# Altium schematic sheet Peripheral.SchDoc: FlightControlBoard-Peripheral
size A4; SheetNumber: 3; SheetTotal: 5
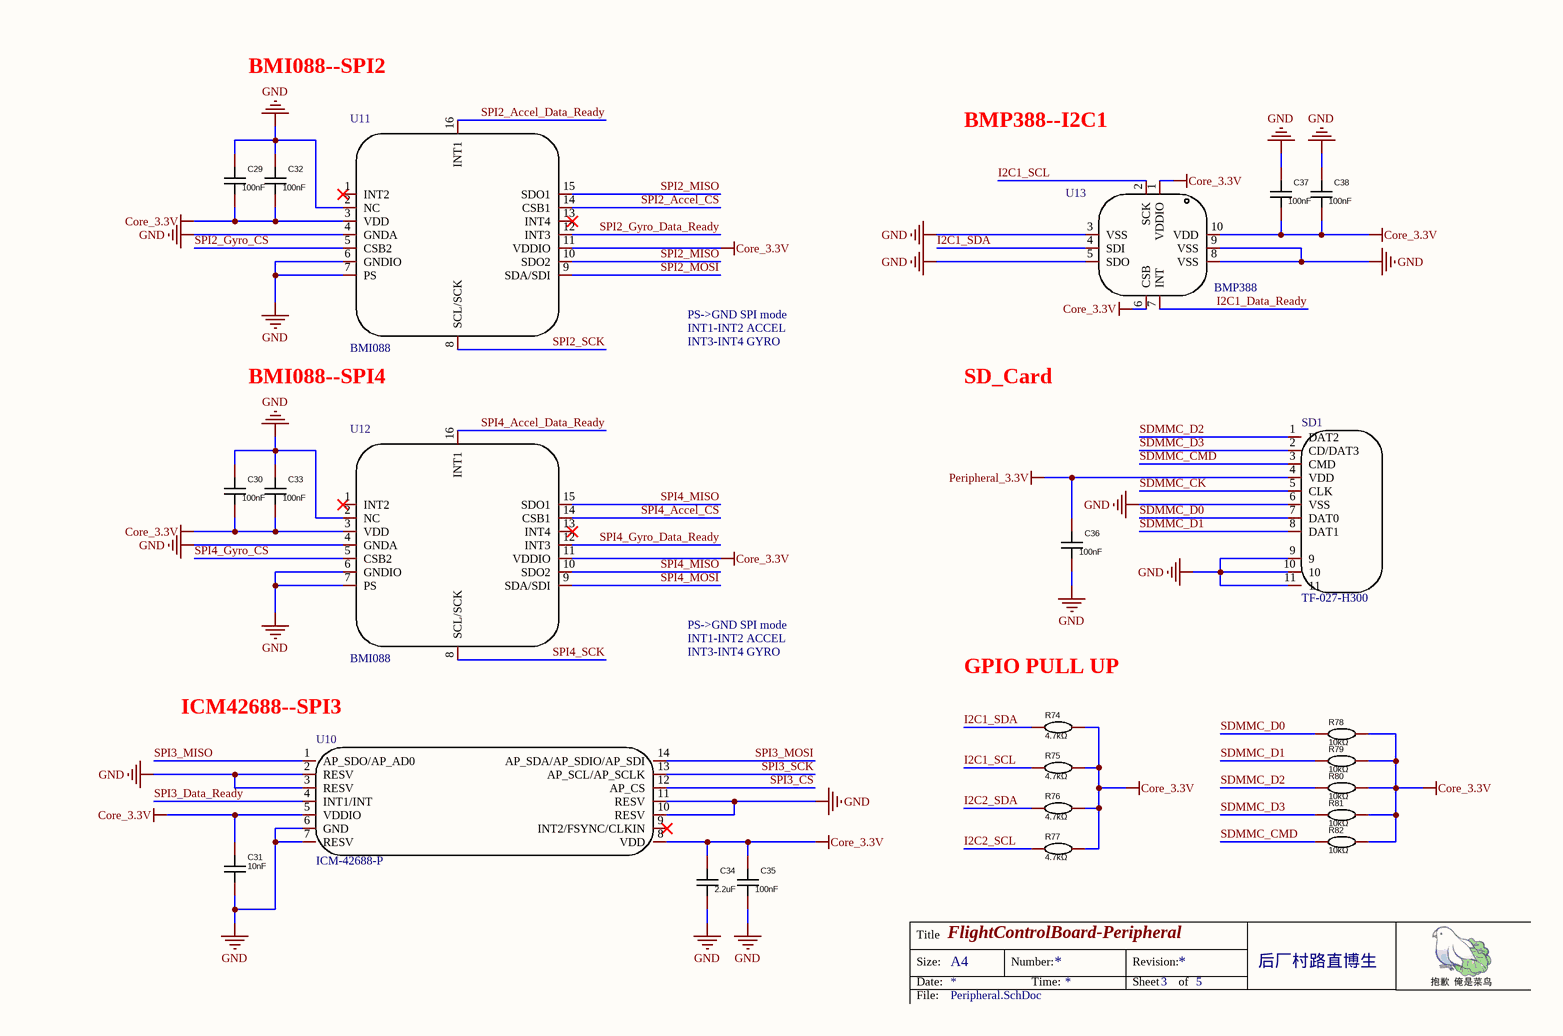
[diagram p0: Peripheral.SchDoc]

## Parts
C29  100nF  [C0201]
C30  100nF  [C0201]
C31  10nF  [C0201]
C32  100nF  [C0201]
C33  100nF  [C0201]
C34  2.2uF  [C0402]
C35  100nF  [C0201]
C36  100nF  [C0201]
C37  100nF  [C0201]
C38  100nF  [C0201]
R74  4.7kΩ  [R0201]
R75  4.7kΩ  [R0201]
R76  4.7kΩ  [R0201]
R77  4.7kΩ  [R0201]
R78  10kΩ  [R0201]
R79  10kΩ  [R0201]
R80  10kΩ  [R0201]
R81  10kΩ  [R0201]
R82  10kΩ  [R0201]
SD1  TF-027-H300  [TF-SMD_HYCW104-TF08-375B]
U10  ICM-42688-P  [LGA-14_L3.0-W2.5-P0.50-TL]
U11  BMI088  [LGA-16_L4.5-W3.0-P0.50-BL]
U12  BMI088  [LGA-16_L4.5-W3.0-P0.50-BL]
U13  BMP388  [LGA-10]

## Nets
Core_3.3V: C29.1 C30.1 C31.1 C32.1 C33.1 C34.2 C35.2 C37.1 C38.1 R74.2 R75.2 R76.2 R77.2 R78.2 R79.2 R80.2 R81.2 R82.2 U10.5(VDDIO) U10.8(VDD) U11.3(VDD) U11.11(VDDIO) U12.3(VDD) U12.11(VDDIO) U13.1(VDDIO) U13.6(CSB) U13.10(VDD)
GND: C29.2 C30.2 C31.2 C32.2 C33.2 C34.1 C35.1 C36.1 C37.2 C38.2 SD1.6(VSS) SD1.9 SD1.10 SD1.11 U10.2(RESV) U10.3(RESV) U10.6(GND) U10.7(RESV) U10.10(RESV) U10.11(RESV) U11.2(NC) U11.4(GNDA) U11.6(GNDIO) U11.7(PS) U12.2(NC) U12.4(GNDA) U12.6(GNDIO) U12.7(PS) U13.3(VSS) U13.5(SDO) U13.8(VSS) U13.9(VSS)
Peripheral_3.3V: C36.2 SD1.4(VDD)
I2C1_Data_Ready: U13.7(INT)
I2C1_SCL: R75.1 U13.2(SCK)
I2C1_SDA: R74.1 U13.4(SDI)
I2C2_SCL: R77.1
I2C2_SDA: R76.1
SDMMC_CK: SD1.5(CLK)
SDMMC_CMD: R82.1 SD1.3(CMD)
SDMMC_D0: R78.1 SD1.7(DAT0)
SDMMC_D1: R79.1 SD1.8(DAT1)
SDMMC_D2: R80.1 SD1.1(DAT2)
SDMMC_D3: R81.1 SD1.2(CD/DAT3)
SPI2_Accel_CS: U11.14(CSB1)
SPI2_Accel_Data_Ready: U11.16(INT1)
SPI2_Gyro_CS: U11.5(CSB2)
SPI2_Gyro_Data_Ready: U11.12(INT3)
SPI2_MISO: U11.10(SDO2) U11.15(SDO1)
SPI2_MOSI: U11.9(SDA/SDI)
SPI2_SCK: U11.8(SCL/SCK)
SPI3_CS: U10.12(AP_CS)
SPI3_Data_Ready: U10.4(INT1/INT)
SPI3_MISO: U10.1(AP_SDO/AP_AD0)
SPI3_MOSI: U10.14(AP_SDA/AP_SDIO/AP_SDI)
SPI3_SCK: U10.13(AP_SCL/AP_SCLK)
SPI4_Accel_CS: U12.14(CSB1)
SPI4_Accel_Data_Ready: U12.16(INT1)
SPI4_Gyro_CS: U12.5(CSB2)
SPI4_Gyro_Data_Ready: U12.12(INT3)
SPI4_MISO: U12.10(SDO2) U12.15(SDO1)
SPI4_MOSI: U12.9(SDA/SDI)
SPI4_SCK: U12.8(SCL/SCK)

Not connected (* = marked no-connect by the designer): U10 9(INT2/FSYNC/CLKIN)*; U11 1(INT2)* 13(INT4)*; U12 1(INT2)* 13(INT4)*

## Notes on the sheet
- BMI088--SPI2
- BMP388--I2C1
- (near U11) BMI088--SPI4
- PS->GND SPI mode
- INT1-INT2 ACCEL
- INT3-INT4 GYRO
- SD_Card
- ICM42688--SPI3
- (near R74) GPIO PULL UP
- Title
- Size:
- Date:
- A4
- Number:
- Time:
- Revision:
- Sheet
- of
- 后厂村路直博生
- File:

## Library data of the parts
C29-C38 = CC0603KRX7R9BB104: Add into BOM: yes; Convert to PCB: yes
  C29 C30 C32 C33 C35-C38: Name: 100nF; Value: 100nF
  C31: Name: 10nF; Value: 10nF
  C34: Name: 2.2uF; Value: 2.2uF
R74-R82 = 0603WAF1002T5E: Add into BOM: yes; Convert to PCB: yes
  R74-R77: Name: 4.7kΩ; Value: 4.7kΩ
  R78-R82: Name: 10kΩ; Value: 10kΩ
SD1 = TF-027-H300: Manufacturer: HANBO(汉博); Add into BOM: yes; Card Connection Mode: 拔插式; Card Type: MicroSD卡(TF卡); Connector Type: 卡座; Maximum Body Height: 3mm; Symbol: TF-027-H300; Device: TF-027-H300; Supplier: LCSC; Supplier Part: C5310495; Manufacturer Part: TF-027-H300; JLCPCB Part Class: Extended Part; LCSC Part Name: 拔插式 MicroSD卡(TF卡) 卡座; Supplier Footprint: SMD; Datasheet: https://atta.szlcsc.com/upload/public/pdf/source/20221209/91D0698AD722546CAE445F87A6450B20.pdf; Convert to PCB: yes; Contact Material: -; Contact Plating: 镀金; Operating Temperature Range: -20℃~+85℃; Welding Temperature (Max): -
U10 = ICM-42688-P: Manufacturer: TDK InvenSense(应美盛); Add into BOM: yes; Name: ICM-42688-P; Symbol: ICM-42688-P; Device: ICM-42688-P; LCSC Part Name: ICM 42688 P; Supplier Part: C1850418; Manufacturer Part: ICM-42688-P; Supplier Footprint: LGA-14(2.5x3); JLCPCB Part Class: Extended Part; Datasheet: https://atta.szlcsc.com/upload/public/pdf/source/20210703/CF24204867ACE5B754A2B035F23E5931.pdf; Supplier: LCSC; Convert to PCB: yes
U11 U12 = BMI088: Manufacturer: Bosch(博世); Add into BOM: yes; Name: BMI088; Symbol: BMI088; Device: BMI088; LCSC Part Name: BMI088; Supplier Part: C194919; Manufacturer Part: BMI088; Supplier Footprint: LGA-16; JLCPCB Part Class: Extended Part; Datasheet: https://atta.szlcsc.com/upload/public/pdf/source/20180628/C194919_66CCF125FF968C218A4D358C68AC68D6.pdf; Supplier: LCSC; Convert to PCB: yes
U13 = BMP388: Manufacturer: Bosch(博世); Add into BOM: yes; Name: BMP388; Symbol: BMP388; Device: BMP388; LCSC Part Name: BMP388; Supplier Part: C779278; Manufacturer Part: BMP388; Supplier Footprint: LGA-10; JLCPCB Part Class: Extended Part; Datasheet: https://atta.szlcsc.com/upload/public/pdf/source/20211019/91C230A1D32F1E776DA878FFB43C8B15.pdf; Supplier: LCSC; Convert to PCB: yes